# EAGLE design LockNFC (EAGLE 9.3.1)

## Sheet 1 of 2
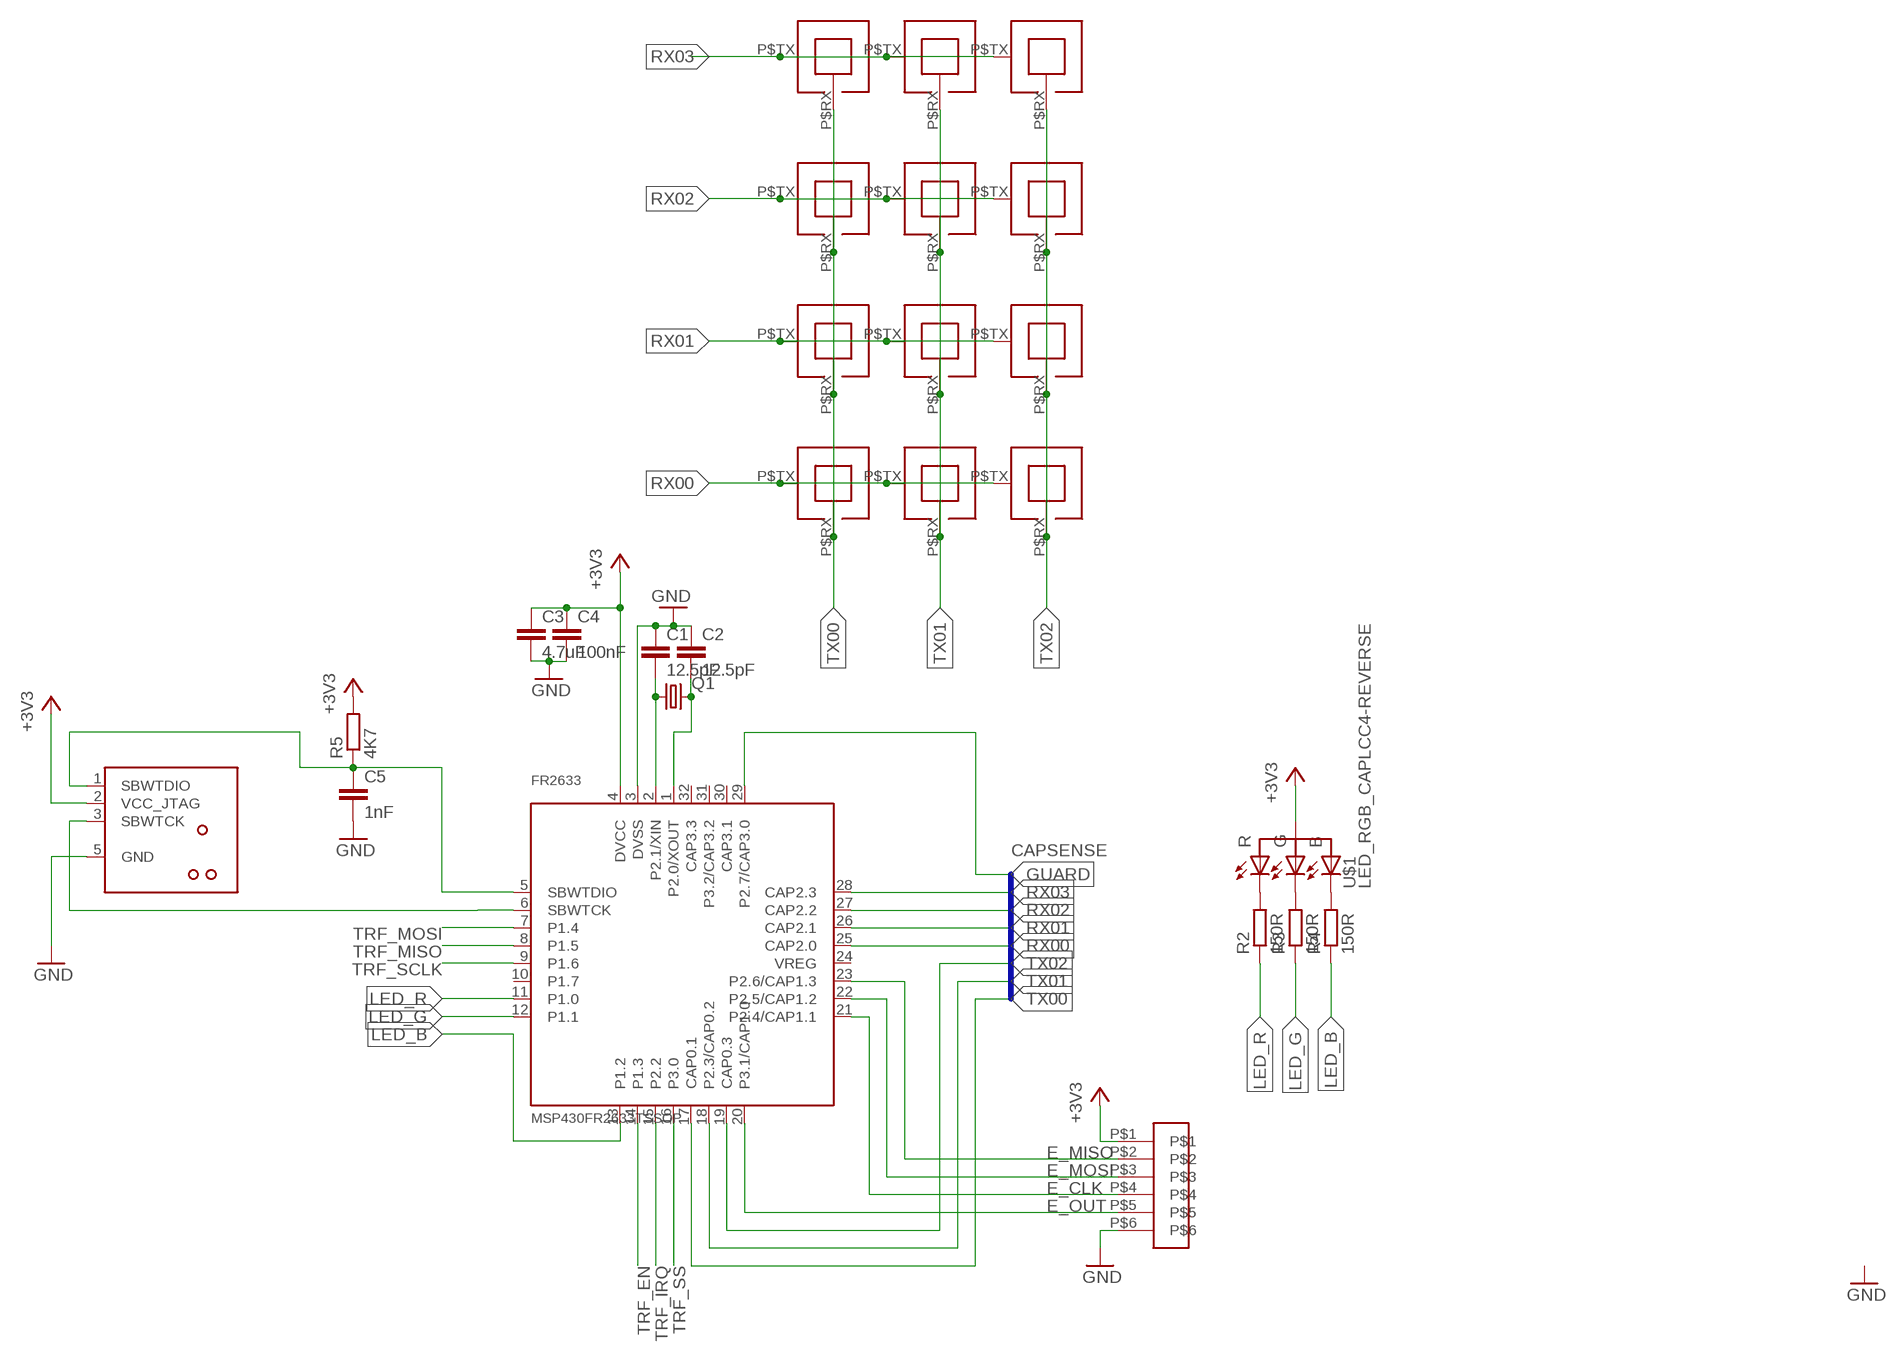
[diagram p0: schematic, sheet 1]

### Parts
C1  12.5pF  C-EU_C0805  [C0805]
C2  12.5pF  C-EU_C0805  [C0805]
C3  4.7uF  C-EU_C0805  [C0805]
C4  100nF  C-EU_C0805  [C0805]
C5  1nF  C-EU_C0805  [C0805]
FR2633  MSP430FR2633TSSOP  [TSSOP(DA)32]
J1  TC2030-MSP430-NO-UART-NL  [TC2030-MSP430-NL-NO-UART]
Q1  CRYSTALFC-135  [FC-135]
R2  150R  R-EU_R0603  [R0603]
R3  150R  R-EU_R0603  [R0603]
R4  150R  R-EU_R0603  [R0603]
R5  4K7  R-EU_R0603  [R0603]
U$1  LED_RGB_CAPLCC4-REVERSE  [PLCC4-REVERSE]
U$2  CAP_MUTUAL_SMALL  [CAP_MUTUAL_SMALL]
U$3  CAP_MUTUAL_SMALL  [CAP_MUTUAL_SMALL]
U$4  CAP_MUTUAL_SMALL  [CAP_MUTUAL_SMALL]
U$5  CAP_MUTUAL_SMALL  [CAP_MUTUAL_SMALL]
U$6  CAP_MUTUAL_SMALL  [CAP_MUTUAL_SMALL]
U$7  CAP_MUTUAL_SMALL  [CAP_MUTUAL_SMALL]
U$8  CAP_MUTUAL_SMALL  [CAP_MUTUAL_SMALL]
U$9  CAP_MUTUAL_SMALL  [CAP_MUTUAL_SMALL]
U$10  CAP_MUTUAL_SMALL  [CAP_MUTUAL_SMALL]
U$11  CAP_MUTUAL_SMALL  [CAP_MUTUAL_SMALL]
U$12  CAP_MUTUAL_SMALL  [CAP_MUTUAL_SMALL]
U$13  CAP_MUTUAL_SMALL  [CAP_MUTUAL_SMALL]
U$14  1X6_SMD_HEADER  [1X6-SMD-1.27MM]

### Nets
+3V3: C3.1 C4.1 FR2633.4(DVCC) J1.2(VCC_JTAG) R5.2 U$1.P$2(A) U$14.P$1 ; also sheet 2
E_CLK: FR2633.21(P2.4/CAP1.1) U$14.P$4
E_MISO: FR2633.23(P2.6/CAP1.3) U$14.P$2
E_MOSI: FR2633.22(P2.5/CAP1.2) U$14.P$3
E_OUT: FR2633.20(P3.1/CAP1.0) U$14.P$5
GND: C1.1 C2.1 C3.2 C4.2 C5.2 FR2633.3(DVSS) J1.5(GND) U$14.P$6 ; also sheet 2
GUARD: FR2633.29(P2.7/CAP3.0)
LED_B: FR2633.13(P1.2) R4.1
LED_G: FR2633.12(P1.1) R3.1
LED_R: FR2633.11(P1.0) R2.1
N$1: R2.2 U$1.P$1(C_RED)
N$2: R3.2 U$1.P$4(C_GREEN)
N$3: R4.2 U$1.P$3(C_BLUE)
RX00: FR2633.25(CAP2.0) U$11.P$TX(TX) U$12.P$TX(TX) U$13.P$TX(TX)
RX01: FR2633.26(CAP2.1) U$8.P$TX(TX) U$9.P$TX(TX) U$10.P$TX(TX)
RX02: FR2633.27(CAP2.2) U$5.P$TX(TX) U$6.P$TX(TX) U$7.P$TX(TX)
RX03: FR2633.28(CAP2.3) U$2.P$TX(TX) U$3.P$TX(TX) U$4.P$TX(TX)
SBWTCK: FR2633.6(SBWTCK) J1.3(SBWTCK)
SBWTDIO: C5.1 FR2633.5(SBWTDIO) J1.1(SBWTDIO) R5.1
TRF_EN: FR2633.14(P1.3) ; also sheet 2
TRF_IRQ: FR2633.15(P2.2) ; also sheet 2
TRF_MISO: FR2633.8(P1.5) ; also sheet 2
TRF_MOSI: FR2633.7(P1.4) ; also sheet 2
TRF_SCLK: FR2633.9(P1.6) ; also sheet 2
TRF_SS: FR2633.16(P3.0) ; also sheet 2
TX00: FR2633.17(CAP0.1) U$2.P$RX(RX) U$5.P$RX(RX) U$8.P$RX(RX) U$11.P$RX(RX)
TX01: FR2633.18(P2.3/CAP0.2) U$3.P$RX(RX) U$6.P$RX(RX) U$9.P$RX(RX) U$12.P$RX(RX)
TX02: FR2633.19(CAP0.3) U$4.P$RX(RX) U$7.P$RX(RX) U$10.P$RX(RX) U$13.P$RX(RX)
XIN: C1.2 FR2633.2(P2.1/XIN) Q1.1
XOUT: C2.2 FR2633.1(P2.0/XOUT) Q1.2
Unconnected: FR2633.24(VREG) FR2633.30(CAP3.1) FR2633.31(P3.2/CAP3.2) FR2633.32(CAP3.3)

### Buses
CAPSENSE

## Sheet 2 of 2
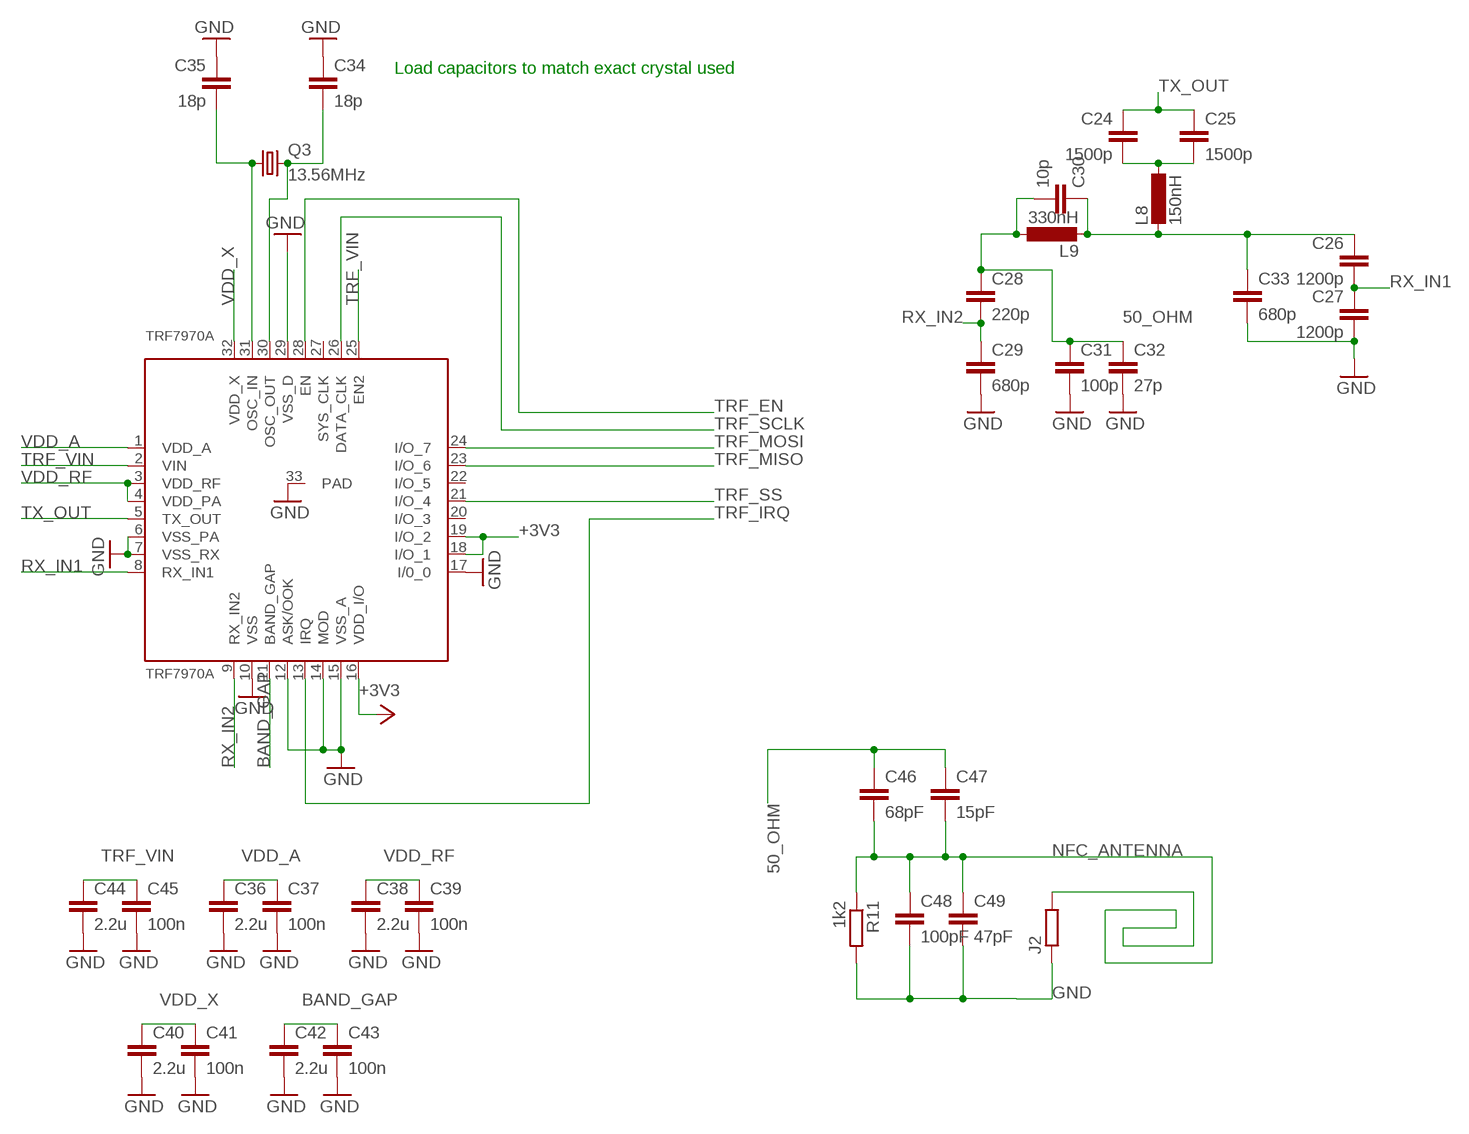
[diagram p1: schematic, sheet 2]

### Parts
C24  1500p  C-EUC0805  [C0805]
C25  1500p  C-EUC0805  [C0805]
C26  1200p  C-EUC0805  [C0805]
C27  1200p  C-EUC0805  [C0805]
C28  220p  C-EUC0805  [C0805]
C29  680p  C-EUC0805  [C0805]
C30  10p  C-EUC0805  [C0805]
C31  100p  C-EUC0805  [C0805]
C32  27p  C-EUC0805  [C0805]
C33  680p  C-EUC0805  [C0805]
C34  18p  C-EU_C0805  [C0805]
C35  18p  C-EU_C0805  [C0805]
C36  2.2u  C-EU_C0805  [C0805]
C37  100n  C-EU_C0805  [C0805]
C38  2.2u  C-EU_C0805  [C0805]
C39  100n  C-EU_C0805  [C0805]
C40  2.2u  C-EU_C0805  [C0805]
C41  100n  C-EU_C0805  [C0805]
C42  2.2u  C-EU_C0805  [C0805]
C43  100n  C-EU_C0805  [C0805]
C44  2.2u  C-EU_C0805  [C0805]
C45  100n  C-EU_C0805  [C0805]
C46  68pF  C-EUC0805  [C0805]
C47  15pF  C-EUC0805  [C0805]
C48  100pF  C-EUC0805  [C0805]
C49  47pF  C-EUC0805  [C0805]
J2  R-EU_R0402  [R0402]
L8  150nH  L-EU_L1008  [L1008]
L9  330nH  L-EU_L1008  [L1008]
Q3  13.56MHz  CRYSTAL_TXC  [CRYSTAL_TCX]
R11  1k2  R-EU_R0805  [R0805]
TRF7970A  TRF7970A  [QFN(RHB)32]

### Nets
50_OHM: C28.1 C30.2 C31.1 C32.1 C46.1 C47.1 L9.1
+3V3: TRF7970A.16(VDD_I/O) TRF7970A.18(I/O_1) TRF7970A.19(I/O_2) ; also sheet 1
BAND_GAP: C42.1 C43.1 TRF7970A.11(BAND_GAP)
GND: C27.2 C29.2 C31.2 C32.2 C33.2 C34.1 C35.1 C36.2 C37.2 C38.2 C39.2 C40.2 C41.2 C42.2 C43.2 C44.2 C45.2 C48.2 C49.2 J2.1 R11.2 TRF7970A.6(VSS_PA) TRF7970A.7(VSS_RX) TRF7970A.10(VSS) TRF7970A.12(ASK/OOK) TRF7970A.14(MOD) TRF7970A.15(VSS_A) TRF7970A.17(I/0_0) TRF7970A.29(VSS_D) TRF7970A.33(PAD) ; also sheet 1
N$7: C24.2 C25.2 L8.1
N$9: C26.1 C30.1 C33.1 L8.2 L9.2
N$10: C35.2 Q3.1 TRF7970A.31(OSC_IN)
N$11: C34.2 Q3.2 TRF7970A.30(OSC_OUT)
NFC_ANTENNA: C46.2 C47.2 C48.1 C49.1 J2.2 R11.1
RX_IN1: C26.2 C27.1 TRF7970A.8(RX_IN1)
RX_IN2: C28.2 C29.1 TRF7970A.9(RX_IN2)
TRF_EN: TRF7970A.28(EN) ; also sheet 1
TRF_IRQ: TRF7970A.13(IRQ) ; also sheet 1
TRF_MISO: TRF7970A.23(I/O_6) ; also sheet 1
TRF_MOSI: TRF7970A.24(I/O_7) ; also sheet 1
TRF_SCLK: TRF7970A.26(DATA_CLK) ; also sheet 1
TRF_SS: TRF7970A.21(I/O_4) ; also sheet 1
TRF_VIN: C44.1 C45.1 TRF7970A.2(VIN) TRF7970A.25(EN2)
TX_OUT: C24.1 C25.1 TRF7970A.5(TX_OUT)
VDD_A: C36.1 C37.1 TRF7970A.1(VDD_A)
VDD_RF: C38.1 C39.1 TRF7970A.3(VDD_RF) TRF7970A.4(VDD_PA)
VDD_X: C40.1 C41.1 TRF7970A.32(VDD_X)
Unconnected: TRF7970A.20(I/O_3) TRF7970A.22(I/O_5) TRF7970A.27(SYS_CLK)

### Notes on the sheet
- Load capacitors to match exact crystal used

## Power pins joined to a net without a drawn wire
P1.7: FR2633.10(P1.7)

## Library data of the parts
C1-C5 = 0xfred:C-EU_: CAPACITOR, European symbol
C24-C33 C46-C49 = FredMiscellaneous:C-EU: CAPACITOR, European symbol
C34-C45 = FredMiscellaneous:C-EU_: CAPACITOR, European symbol
FR2633 = 0xfred:MSP430FR2633
J1 = tag-connect-msp430:TC2030-MSP430-NO-UART: TAG-CONNECT SBW Connector Manufacturer: Tag-Connect <http://www.tag-connect.com> Cable for SBW programming via FET430UIF or MSP-FET. The UART back-channel connections normally present have been omitted for boards that do not need it. This allows more space for routing traces between these unused pins. A smaller keepout area has been retained in case the pins pierce the soldermask. NOTE: Eagle's default spacing for drill holes does not leave sufficent room for routing traces for this footprint and should be adjusted. This setting can be found in the board layout editor under the Edit menu. Select "Design Rules" and then the Distance tab. 8 mils for Drill/Hole works well. PAD Description 1 SBWTDIO 2 VCC JTAG OUT 3 SBWTCK 4 - 5 GND 6 - ©2014 Fred - adapted from TagConnect's MCP version.
J2 = rcl:R-EU_: RESISTOR, European symbol; SPICEPREFIX: R
L8 L9 = FredMiscellaneous:L-EU_: INDUCTOR, European symbol
Q1 = 0xfred:CRYSTAL: CRYSTAL
Q3 = crystal_txc:CRYSTAL_TXC: TXC - 7A-16.000MAAJ-T - XTAL, 16.000MHZ, 18PF, SMD, 5.0X3.2
R2-R5 = 0xfred:R-EU_: RESISTOR, European symbol
R11 = FredMiscellaneous:R-EU_: RESISTOR, European symbol
TRF7970A = FredMiscellaneous:TRF7970A: TRF7970ARHB
U$1 = 0xfred:LED_RGB_CA: RGB LED common anode
U$2-U$13 = 0xfred:CAP_MUTUAL_SMALL
U$14 = 0xfred:1X6_SMD_HEADER

## Board
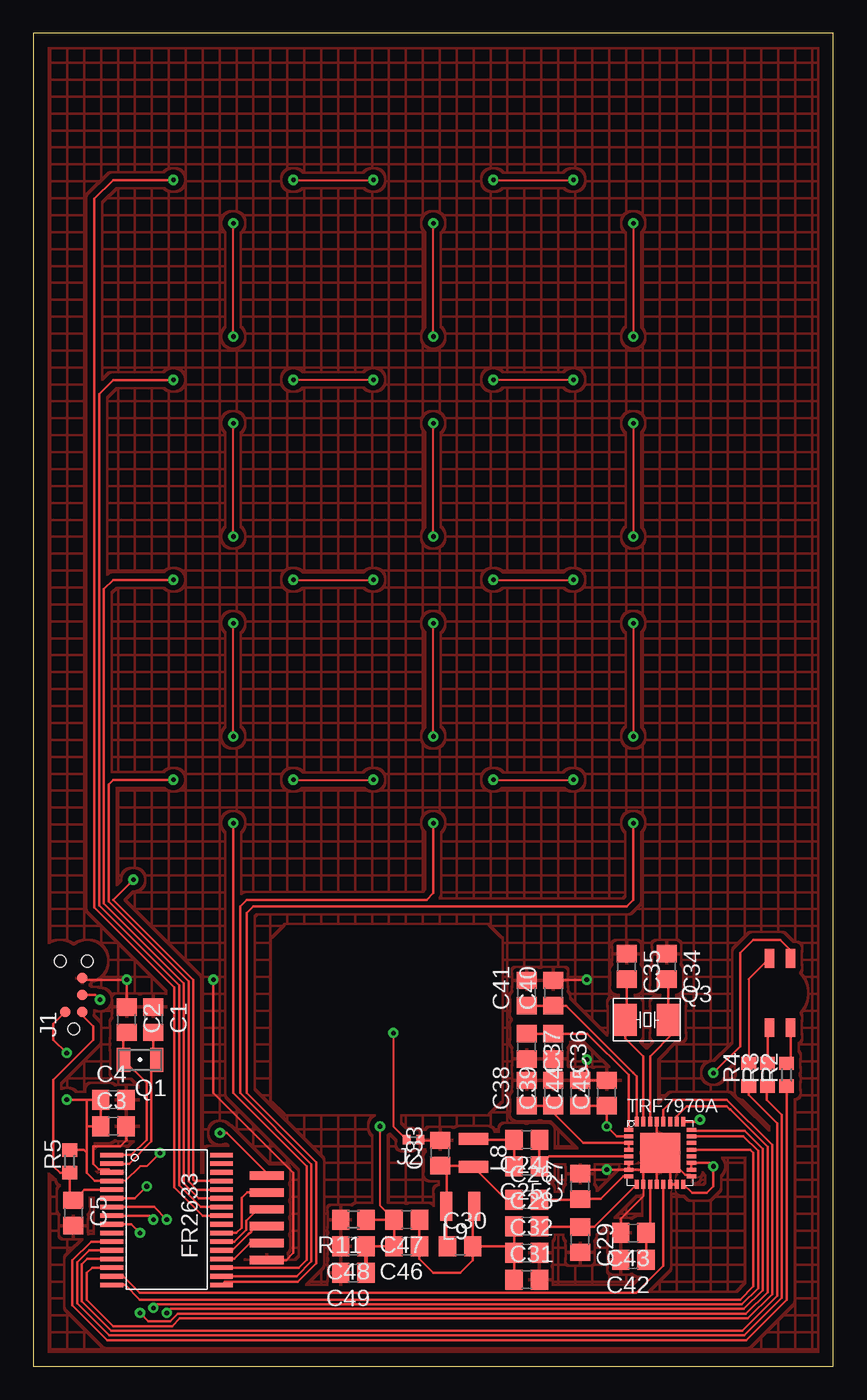
[diagram p2: board, top side]
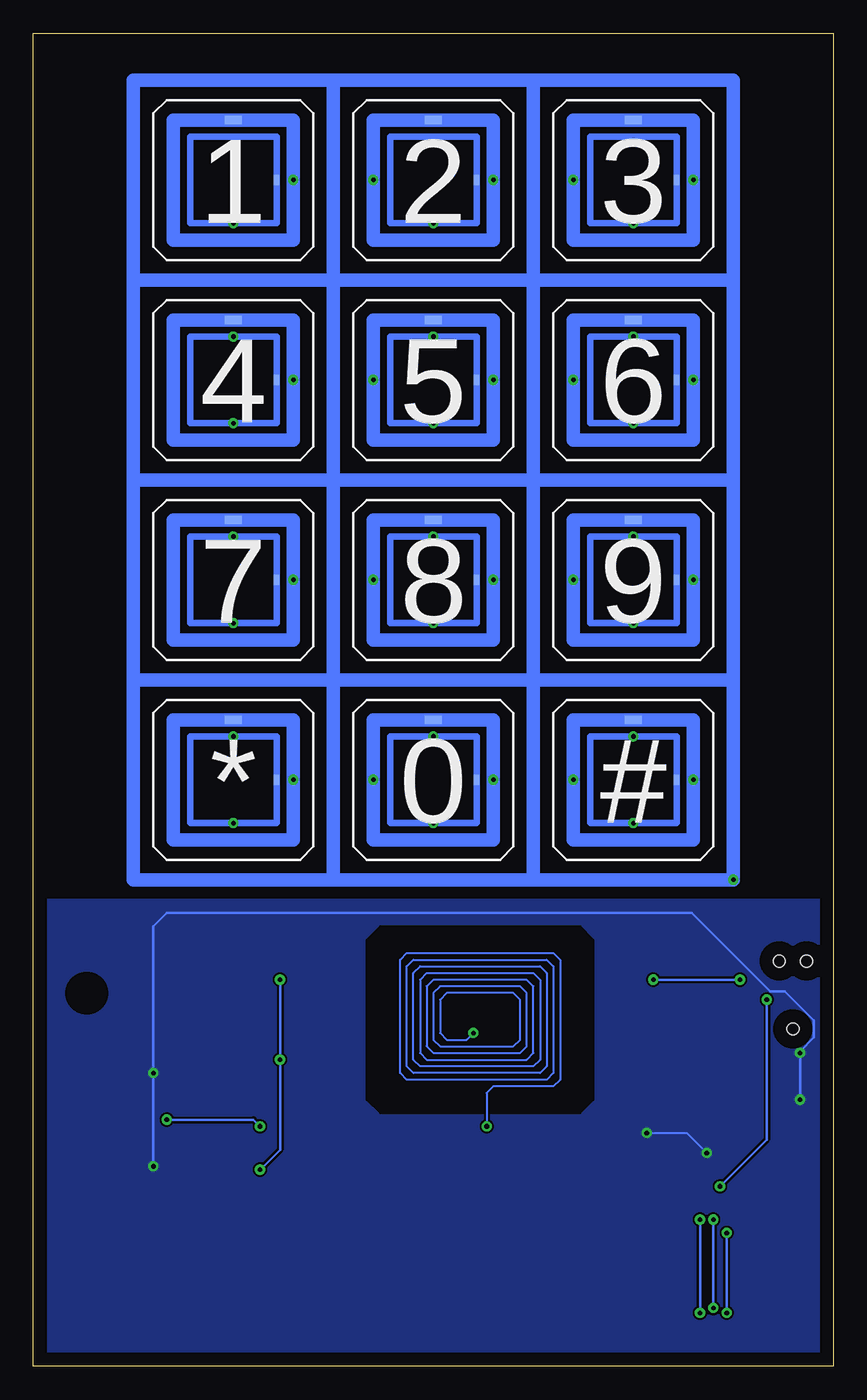
[diagram p3: board, bottom side, seen from below]

Size 60 x 100 mm. Coordinates in mm from the lower left corner, seen from the top.
Outline: 0,0 60,0 60,100 0,100 0,0
Copper layers (1*16): Top 0.035mm / dielectric 1.5mm / Bottom 0.035mm
Design rules "default *": minimum track width 6mil, minimum drill 0.35mm, track to track 6mil, track to pad 6mil, pad to pad 6mil, via to via 6mil, smd to smd 6mil, copper to edge 40mil, drill to drill 6mil, minimum pad ring 10mil, minimum via ring 8mil, stop-mask expansion 4mil, vias tented up to drill 30mil, thermal gap 10mil

### Footprints (pad centres in the part's own frame; a part is rotated, then mirrored left to right if it is on the bottom)
C0805 = smd 1.3 x 1.5: 1 -0.95,0; 2 0.95,0
TSSOP(DA)32 = smd 0.35 x 1.705: 1 -5.85,-4.12; 2 -5.2,-4.12; 3 -4.55,-4.12; 4 -3.9,-4.12; 5 -3.25,-4.12; 6 -2.6,-4.12; 7 -1.95,-4.12; 8 -1.3,-4.12; 9 -0.65,-4.12; 10 0,-4.12; 11 0.65,-4.12; 12 1.3,-4.12; 13 1.95,-4.12; 14 2.6,-4.12; 15 3.25,-4.12; 16 3.9,-4.12; 17 3.9,4.12; 18 3.25,4.12; 19 2.6,4.12; 20 1.95,4.12; 21 1.3,4.12; 22 0.65,4.12; 23 0,4.12; 24 -0.65,4.12; 25 -1.3,4.12; 26 -1.95,4.12; 27 -2.6,4.12; 28 -3.25,4.12; 29 -3.9,4.12; 30 -4.55,4.12; 31 -5.2,4.12; 32 -5.85,4.12
TC2030-MSP430-NL-NO-UART = smd 0.787 x 0.787: 1 1.27,-0.635; 2 1.27,0.635; 3 2.54,-0.635; 5 3.81,-0.635 | hole 0.889: 0,0; 5.08,-1.016; 5.08,1.016
R0402 = smd 0.6 x 0.7: 1 -0.5,0; 2 0.5,0
L1008 = smd 0.9 x 2.2: 1 -1.05,0; 2 1.05,0
FC-135 = smd 1 x 1.8: 1 -1.25,0; 2 1.25,0
CRYSTAL_TCX = smd 1.7 x 2.4: 1 -1.6,0; 2 1.6,0
R0603 = smd 1 x 1.1: 1 -0.85,0; 2 0.85,0
R0805 = smd 1.3 x 1.5: 1 -0.95,0; 2 0.95,0
QFN(RHB)32 = smd 0.7 x 0.3: 1 -2.35,1.75; 2 -2.35,1.25; 3 -2.35,0.75; 4 -2.35,0.25; 5 -2.35,-0.25; 6 -2.35,-0.75; 7 -2.35,-1.25; 8 -2.35,-1.75; 17 2.35,-1.75; 18 2.35,-1.25; 19 2.35,-0.75; 20 2.35,-0.25; 21 2.35,0.25; 22 2.35,0.75; 23 2.35,1.25; 24 2.35,1.75 | smd 0.3 x 0.7: 9 -1.75,-2.35; 10 -1.25,-2.35; 11 -0.75,-2.35; 12 -0.25,-2.35; 13 0.25,-2.35; 14 0.75,-2.35; 15 1.25,-2.35; 16 1.75,-2.35; 25 1.75,2.35; 26 1.25,2.35; 27 0.75,2.35; 28 0.25,2.35; 29 -0.25,2.35; 30 -0.75,2.35; 31 -1.25,2.35; 32 -1.75,2.35 | smd 3 x 3: 33 0,0
PLCC4-REVERSE = smd 1.422 x 0.711: P$1 -2.6,-0.8; P$2 2.6,-0.8; P$3 2.6,0.8; P$4 -2.6,0.8
CAP_MUTUAL_SMALL = smd 0.406 x 0.813: P$RX -3.25,0 | smd 1.27 x 0.635: P$TX 0,-4.5
1X6-SMD-1.27MM = smd 2.54 x 0.635: P$1 0,3.81; P$2 0,2.54; P$3 0,1.27; P$4 0,0; P$5 0,-1.27; P$6 0,-2.54

### Placement (x,y rotation side)
C1  9,26 270 top
C2  7,26 270 top
C3  6,18 0 top
C4  6,20 0 top
C5  3,11.5 270 top
C24  37,17 180 top
C25  37,15 180 top
C26  37,12.5 0 top
C27  41,13.5 90 top
C28  37,10.5 0 top
C29  41,9.5 270 top
C30  32,9 0 top
C31  37,6.5 0 top
C32  37,8.5 0 top
C33  30.5,16 90 top
C34  47.5,30 270 top
C35  44.5,30 270 top
C36  39,24 270 top
C37  37,24 270 top
C38  37,20.5 90 top
C39  39,20.5 90 top
C40  39,28 90 top
C41  37,28 90 top
C42  45,8 180 top
C43  45,10 180 top
C44  41,20.5 90 top
C45  43,20.5 90 top
C46  28,9 180 top
C47  28,11 180 top
C48  24,9 180 top
C49  24,7 180 top
FR2633  10,10 270 top
J1  3.03,25.31 90 top
J2  28.5,17 180 top
L8  33,16 270 top
L9  32,12 180 top
Q1  8,23 180 top
Q3  46,26 0 top
R2  56.49,21.87 90 top
R3  55.07,21.87 90 top
R4  53.65,21.87 90 top
R5  2.73,15.37 90 top
R11  24,11 180 top
TRF7970A  47,16 0 top
U$1  56,28 90 top
U$2  45,44 180 bottom
U$3  30,44 180 bottom
U$4  15,44 180 bottom
U$5  45,59 180 bottom
U$6  30,59 180 bottom
U$7  15,59 180 bottom
U$8  45,74 180 bottom
U$9  30,74 180 bottom
U$10  15,74 180 bottom
U$11  45,89 180 bottom
U$12  30,89 180 bottom
U$13  15,89 180 bottom
U$14  17.5,10.5 0 top

### Tracks (layer width: path | path; a pad name or v marks a point on that pad's centre or on a via)
50_OHM
  Top 0.152: C32.1 35.55,9
  Top 0.203: C47.1 C46.1 28.95,8.05 30,7 32,7 32.95,7.95 C30.2 | L9.1 32.95,11.9 C30.2 | C28.1 C32.1 C31.1 | 35.55,9 C30.2
+3V3  (via drill 0.35)
  Top 0.152: 5,20.05 C4.1 | v9.5,16 8.5,15 8,15 6.9,13.9 FR2633.4
  Top 0.203: 4,18 4,20 5,20 | 4,18 4,17 4,16 | 4,16 4,14.5 4.6,13.9 FR2633.4 | 4,18 C3.1 C4.1 5,20 | TRF7970A.16 49.4,13 50.5,13 51,13.5 v51,15 50.75,15.25 TRF7970A.19 TRF7970A.18 | R5.2 3.78,16.22 4,16 | v51,22 53,24 53,31 54,32 56,32 56.8,31.2 U$1.P$2 | J1.2 1.5,25.68 1.5,24.5 v2.5,23.5 | v2.5,20 5,20 | v14,17.5 14.5,17.5 17.5,14.5 U$14.P$1
  Bottom 0.152: v14,17.5 11,17.5 v9.5,16
  Bottom 0.203: v51,15 v51,22 51,33 50,34 10.61,34 4.74,28.13 3.64,28.13 1.47,25.96 1.47,24.66 2.5,23.63 v2.5,23.5 v2.5,20
  pour Bottom: 1,1 1,35 59,35 59,1
BAND_GAP
  Top 0.152: 46.25,10.3 C43.1
  Top 0.203: TRF7970A.11 46.25,12 46.25,10.3 | C43.1 C42.1
E_CLK
  Top 0.203: 16.12,9.88 14.93,8.7 FR2633.21 | 16.12,9.88 16.33,10.1 | 16.12,9.88 16.73,10.5 U$14.P$4
E_MISO
  Top 0.203: FR2633.23 15.23,10 15.62,10.39 15.62,12.62 16.04,13.04 U$14.P$2
E_MOSI
  Top 0.203: FR2633.22 15.08,9.35 15.98,10.25 15.98,10.92 16.82,11.77 U$14.P$3
E_OUT
  Top 0.203: FR2633.20 15.05,8.05 16.23,9.23 U$14.P$5
GND  (via drill 0.35)
  Top 0.152: 46.75,16.25 TRF7970A.33 | TRF7970A.10 45.75,12.75 44.05,11.05 C43.2 | J2.1 29.05,16.95 C33.2
  Top 0.203: TRF7970A.15 TRF7970A.14 47.75,15 | 47.75,15 47.75,15.25 TRF7970A.33 | TRF7970A.7 v43,14.75 41.3,14.75 C27.2 | TRF7970A.6 TRF7970A.7 | TRF7970A.12 46.75,15.75 TRF7970A.33 | TRF7970A.10 45.75,14.75 | 45.75,14.75 TRF7970A.33 | TRF7970A.7 45.75,14.75 | TRF7970A.29 46.75,16.25 | FR2633.3 5.66,14.77 4.92,14.77 4.5,15.19 4.5,16.5 6.5,16.5 7,17 6.95,17.05 C3.2 | C40.2 39.05,29 v41.5,29 | v41.5,23 41.5,21.95 C44.2 C45.2 | TRF7970A.17 49.25,14.35 48.9,14.35 48.24,15 47.75,15 | J1.5 3.79,29 v7,29 C2.1 | v13.5,29 13.5,20.5 19.5,14.5 19.5,8.5 18.96,7.96 U$14.P$6
  Bottom 0.203: v41.5,29 v41.5,23 41.5,16.25 v43,14.75 | v7,29 v13.5,29
  pour Top (isolate 0.406, hatched): 1,1 59,1 59,99 1,99
GUARD  (via drill 0.35)
  Top 0.203: v7.5,36.5 6,35 12,29 12,14 12.1,13.9 FR2633.29
  Bottom 1: 22.5,36.5 22.5,96.5 | 7.5,66.5 7.5,81.5 | 7.5,51.5 v7.5,36.5 37.5,36.5 | 52.5,66.5 52.5,81.5 | 52.5,81.5 52.5,96.5 37.5,96.5 | 37.5,96.5 22.5,96.5 | 52,51.5 37.5,51.5 | 37.5,51.5 7.5,51.5 | 37.5,36.5 52.5,36.5 52.5,66.5 | 7.5,81.5 52.5,81.5 | 7.5,66.5 52.5,66.5 | 7.5,66.5 7.5,51.5 | 22.5,96.5 7.5,96.5 7.5,81.5 | 37.5,96.5 37.5,89 37.5,51.5 | 37.5,51.5 37.5,36.5
LED_B
  Top 0.203: 55.78,17.22 55.78,17 | 55.78,17 55.78,5.26 53.17,2.66 5.84,2.66 3.64,4.85 3.64,7.64 4.05,8.05 FR2633.13 | 55.78,17 55.78,18.22 53.65,20.35 R4.1
LED_G
  Top 0.203: FR2633.12 4.2,8.7 3.29,7.79 3.29,4.71 5.69,2.3 53.32,2.3 56.13,5.12 56.13,17 | R3.1 55.02,20.98 | 55.02,20.98 55,20.95 | 56.13,17.37 56.13,17 | 56.13,17 56.13,18.87 55,20 55,20.95 | 55,20.95 55.02,20.98
LED_R
  Top 0.203: FR2633.11 4.34,9.35 2.93,7.94 2.93,4.56 5.55,1.95 53.47,1.95 56.49,4.97 R2.1
N$1
  Top 0.203: R2.2 56.8,23.03 U$1.P$1
N$2
  Top 0.203: R3.2 55.07,25.27 U$1.P$4
N$3
  Top 0.152: U$1.P$3 53.65,29.05 R4.2
N$7
  Top 0.203: C25.2 C24.2 33.05,17 L8.1
N$9
  Top 0.152: L8.2 32.9,15.05 | 31,15.05 C33.1 | L9.2 31,12.05
  Top 0.203: L8.2 35.45,12.5 C26.1 | L9.2 30.95,9.1 C30.1 | 32.9,15.05 31,15.05 31,12.05
N$10
  Top 0.203: C35.2 44.5,26.1 Q3.1 44.4,24.6 45.75,23.25 TRF7970A.31
N$11
  Top 0.203: C34.2 47.6,28.95 Q3.2 48,25.6 48,25 46.25,23.25 TRF7970A.30
NFC_ANTENNA  (via drill 0.35)
  Top 0.152: C47.2 26.05,12 26,12.05 v26,18 | J2.2 27,18 v27,25
  Top 0.203: C48.1 C46.2 C47.2 R11.1
  Top 0.305: C49.1 C48.1
  Bottom 0.152: v26,18 26,20.5 25.5,21 21,21 20.5,21.5 20.5,30.5 21,31 32,31 32.5,30.5 32.5,22 32,21.5 21.5,21.5 21,22 21,30 21.5,30.5 31.5,30.5 32,30 32,22.5 31.5,22 22,22 21.5,22.5 21.5,29.5 22,30 31,30 31.5,29.5 31.5,23 31,22.5 22.5,22.5 22,23 22,29 22.5,29.5 30.5,29.5 31,29 31,23.5 30.5,23 23,23 22.5,23.5 22.5,28.5 23,29 30,29 30.5,28.5 30.5,24 30,23.5 23.5,23.5 23,24 23,28 23.5,28.5 29.5,28.5 30,28 30,24.5 29.5,24 24,24 23.5,24.5 23.5,27.5 24,28 29,28 29.5,27.5 29.5,25 29,24.5 27.5,24.5 v27,25
RX00  (via drill 0.35)
  Top 0.152: v19.5,89 v25.5,89 | v34.5,89 v40.5,89
  Top 0.203: v10.5,89 6,89 4.58,87.58 4.58,34.41 10.58,28.41 10.58,13.41 12.69,11.3 FR2633.25
  Bottom 0.152: v10.5,89 10.5,93.5 U$13.P$TX 19.5,93.5 v19.5,89 | v25.5,89 25.5,93.5 U$12.P$TX 34.5,93.5 v34.5,89 | v40.5,89 40.5,93.5 U$11.P$TX
RX01  (via drill 0.35)
  Top 0.152: v40.5,74 v34.5,74 | v25.5,74 v19.5,74
  Top 0.203: v10.5,74 6,74 4.93,72.93 4.93,34.56 10.93,28.56 10.93,13.56 12.54,11.95 FR2633.26
  Bottom 0.152: v10.5,74 10.5,78.5 U$10.P$TX 19.5,78.5 v19.5,74 | v25.5,74 25.5,78.5 U$9.P$TX 34.5,78.5 v34.5,74 | v40.5,74 40.5,78.5 U$8.P$TX
RX02  (via drill 0.35)
  Top 0.152: v19.5,59 v25.5,59 | v34.5,59 v40.5,59
  Top 0.203: v10.5,59 6,59 5.29,58.29 5.29,34.7 11.29,28.7 11.29,13.71 12.39,12.6 FR2633.27
  Bottom 0.152: v40.5,59 40.5,63.5 U$5.P$TX | v34.5,59 34.5,63.5 U$6.P$TX 25.5,63.5 v25.5,59 | v19.5,59 19.5,63.5 U$7.P$TX 10.5,63.5 v10.5,59
RX03  (via drill 0.35)
  Top 0.152: v19.5,44 v25.5,44 | v34.5,44 v40.5,44
  Top 0.203: v10.5,44 6,44 5.64,43.64 5.64,34.85 11.64,28.85 11.64,13.85 12.25,13.25 FR2633.28
  Bottom 0.152: v40.5,44 40.5,48.5 U$2.P$TX | v34.5,44 34.5,48.5 U$3.P$TX 25.5,48.5 v25.5,44 | v19.5,44 19.5,48.5 U$4.P$TX 10.5,48.5 v10.5,44
RX_IN1
  Top 0.203: TRF7970A.8 44.25,14.25 42.55,12.55 C27.1 40.95,12.5 C26.2
RX_IN2
  Top 0.203: C28.2 38,10.45 C29.1 42.05,10.45 TRF7970A.9
SBWTCK  (via drill 0.35)
  Top 0.203: J1.3 4.65,27.85 v5,27.5 | v8.5,13.5 7.6,12.6 FR2633.6
  Bottom 0.203: v5,27.5 5,17 v8.5,13.5
SBWTDIO
  Top 0.203: FR2633.5 3.8,13.25 C5.1 2.73,12.72 R5.1 2.02,14.52 2,14.5 1.5,15 1.5,21.5 4.5,24.5 4.5,25.5 3.67,26.34 J1.1
TRF_EN
  Top 0.203: TRF7970A.28 47.25,19.25 48,20 52.01,20 55.42,16.59 55.42,5.41 53.59,3.58 10.97,3.58 10.41,3.01 5.99,3.01 4,5 4,7 4.4,7.4 FR2633.14
TRF_IRQ
  Top 0.203: TRF7970A.13 47.25,7.54 45.2,5.5 7.99,5.5 6.73,6.75 FR2633.15
TRF_MISO  (via drill 0.35, 0.35 pad 0.55)
  Top 0.203: TRF7970A.23 53.25,17.25 54.36,16.15 54.36,5.85 53.15,4.64 9.28,4.64 v9,4.37 | v9,11 8.7,11.3 FR2633.8
  Bottom 0.203: v9,11 v9,4.37
TRF_MOSI  (via drill 0.35)
  Top 0.203: TRF7970A.24 49.45,17.65 53.35,17.65 54.71,16.3 54.71,5.71 53.3,4.29 10.29,4.29 v10,4 | FR2633.7 9.05,11.95 v10,11
  Bottom 0.203: v10,4 v10,11
TRF_SCLK  (via drill 0.35)
  Top 0.203: TRF7970A.26 48.25,18.75 49,19.5 52,19.5 52.25,19.25 55.07,16.44 55.07,5.56 53.44,3.93 10.83,3.93 10.26,3.37 8.63,3.37 v8,4 | v8,10 7.35,10.65 FR2633.9
  Bottom 0.203: v8,4 v8,10
TRF_SS
  Top 0.203: TRF7970A.21 50,16.25 50.25,16.25 53.75,16.25 54,16 54,6 53,5 7.98,5 6.88,6.1 FR2633.16
TRF_VIN  (via drill 0.35, 0.35 pad 0.75)
  Top 0.203: TRF7970A.2 43.75,17.25 v43,18 C45.1 C44.1 | TRF7970A.25 49.85,18.35 v50,18.5
  Bottom 0.203: v50,18.5 43.5,18.5 v43,18
TX00  (via drill 0.35)
  Top 0.152: v45,85.75 v45,77.25 | v45,70.75 v45,62.25 | v45,55.75 v45,47.25
  Top 0.203: v45,40.75 45,35 44.5,34.5 16.5,34.5 16,34 16,20.5 21.21,15.29 21.21,7.71 19.83,6.32 14.34,6.32 FR2633.17
  Bottom 0.152: v45,85.75 41.75,85.75 U$11.P$RX | v45,77.25 41.75,77.25 U$8.P$RX 41.75,70.75 v45,70.75 | v45,47.25 41.75,47.25 U$2.P$RX 41.75,40.75 v45,40.75 | v45,55.75 41.75,55.75 U$5.P$RX 41.75,62.25 v45,62.25
TX01  (via drill 0.35)
  Top 0.152: v30,47.25 v30,55.75 | v30,62.25 v30,70.75 | v30,77.25 v30,85.75
  Top 0.203: v30,40.75 30,35.5 29.5,35 16,35 15.5,34.5 15.5,20.5 20.86,15.15 20.86,7.85 19.75,6.75 FR2633.18
  Bottom 0.152: v30,85.75 26.75,85.75 U$12.P$RX | v30,77.25 26.75,77.25 U$9.P$RX 26.75,70.75 v30,70.75 | v30,40.75 26.75,40.75 U$3.P$RX 26.75,47.25 v30,47.25 | v30,62.25 26.75,62.25 U$6.P$RX 26.75,55.75 v30,55.75
TX02  (via drill 0.35)
  Top 0.152: v15,47.25 v15,55.75 | v15,62.25 v15,70.75 | v15,77.25 v15,85.75
  Top 0.203: v15,40.75 15,20.5 20.5,15 20.5,8 19.9,7.4 18.89,7.4 18.88,7.39 16.12,7.39 16.11,7.4 FR2633.19
  Bottom 0.152: v15,85.75 11.75,85.75 U$13.P$RX | v15,70.75 11.75,70.75 U$10.P$RX 11.75,77.25 v15,77.25 | v15,47.25 11.75,47.25 U$4.P$RX 11.75,40.75 v15,40.75 | v15,55.75 11.75,55.75 U$7.P$RX 11.75,62.25 v15,62.25
TX_OUT
  Top 0.203: TRF7970A.5 38.7,15.75 C25.1 C24.1
VDD_A
  Top 0.203: C37.1 C36.1 41.55,24.95 44.65,21.85 44.65,20 TRF7970A.1
VDD_RF
  Top 0.152: 39,19 C39.1
  Top 0.203: C38.1 C39.1 | TRF7970A.4 TRF7970A.3 41.25,16.75 39,19
VDD_X
  Top 0.203: C41.1 38,27.05 C40.1 39.95,27.05 45.01,22 45.01,21.99 45.25,21.75 TRF7970A.32
X
  cutout Top: 19,19 18,20 18,32 19,33 34,33 35,32 35,20 34,19
XIN
  Top 0.203: FR2633.2 7.2,15.2 8.86,16.85 8.86,22.61 Q1.1 9,23.25 C1.2
XOUT
  Top 0.203: FR2633.1 7.35,15.85 8.5,17 8.5,21.25 Q1.2 6.75,24.8 C2.2
Y
  cutout Bottom: 19,19 18,20 18,32 19,33 34,33 35,32 35,20 34,19

### Text on the board
bPlace: 3 | 2 | 1 | 6 | 5 | 4 | 9 | 8 | 7 | # | 0 | *